# Altium project mcb 2.0.PrjPcb
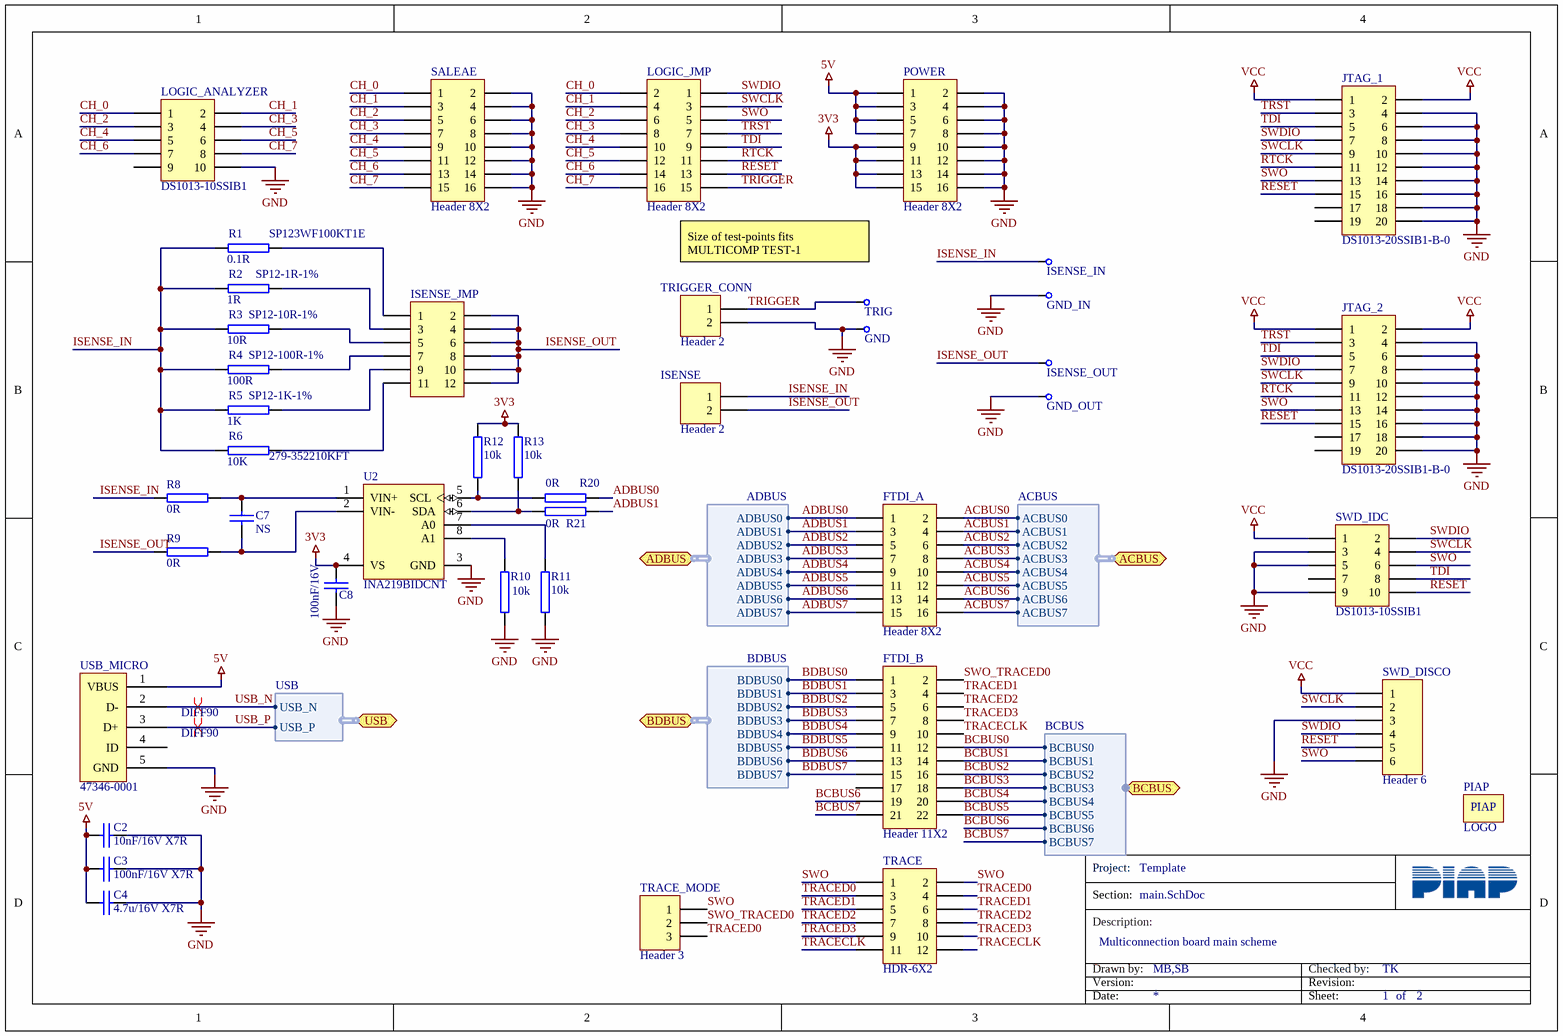
[diagram p0: main.SchDoc]
2 sheets, 79 parts. Net scope: flat (ports and power ports of the same name join across sheets).
Board file: mcb.PcbDoc
Sheets:
  main.SchDoc
  usb_converter.SchDoc

## Sheet main.SchDoc
size A4; CheckedBy: TK; DrawnBy: MB,SB; SheetNumber: 1; SheetTotal: 2; ProjectName: Template

### Parts
C2  10nF/16V X7R  [0805]
C3  100nF/16V X7R  [0805]
C4  4.7u/16V X7R  [0805]
C7  NS  [0603]
C8  100nF/16V  [0402]
FTDI_A  Header 8X2  [HDR2X8]
FTDI_B  Header 11X2  [HDR2X11]
GND  TEST_POINT_THT  [TEST_POINT_THT]  (value not drawn)  (no BOM)
GND_IN  TEST_POINT_THT  [TEST_POINT_THT]  (value not drawn)  (no BOM)
GND_OUT  TEST_POINT_THT  [TEST_POINT_THT]  (value not drawn)  (no BOM)
ISENSE  Header 2  [HDR1X2]
ISENSE_IN  TEST_POINT_THT  [TEST_POINT_THT]  (value not drawn)  (no BOM)
ISENSE_JMP  (no value)  [HDR2X6]
ISENSE_OUT  TEST_POINT_THT  [TEST_POINT_THT]  (value not drawn)  (no BOM)
JTAG_1  DS1013-20SSIB1-B-0  [HDR2X10]
JTAG_2  DS1013-20SSIB1-B-0  [HDR2X10]
LOGIC_ANALYZER  DS1013-10SSIB1  [HDR2X5 socet]
LOGIC_JMP  Header 8X2  [HDR2X8]
PIAP  LOGO  [PIAP_5mm]  (no BOM)
POWER  Header 8X2  [HDR2X8]
R1  0.1R  Manufacturer Part Number: SP123WF100KT1E  [2512]
R2  1R  Supplier Part Number 1: SP12-1R-1%  [2512]
R3  10R  Supplier Part Number 1: SP12-10R-1%  [2512]
R4  100R  Supplier Part Number 1: SP12-100R-1%  [2512]
R5  1K  Supplier Part Number 1: SP12-1K-1%  [2512]
R6  10K  Supplier Part Number 3: 279-352210KFT  [2512]
R8  0R  [0603]
R9  0R  [0603]
R10  10k  [0603]
R11  10k  [0603]
R12  10k  [0603]
R13  10k  [0603]
R20  0R  [0603]
R21  0R  [0603]
SALEAE  Header 8X2  [HDR2X8]
SWD_DISCO  Header 6  [HDR1X6]
SWD_IDC  DS1013-10SSIB1  [HDR2X5 socet]
TRACE  HDR-6X2  [HDR2X6]
TRACE_MODE  Header 3  [HDR1X3]
TRIG  TEST_POINT_THT  [TEST_POINT_THT]  (value not drawn)  (no BOM)
TRIGGER_CONN  Header 2  [HDR1X2]
U2  INA219BIDCNT  [DCN0008A_M]
USB_MICRO  47346-0001  [47346-0001]

### Ports
ACBUS (bidir, harness ACBUS), ADBUS (bidir, harness ADBUS), BCBUS (bidir, harness BCBUS), BDBUS (bidir, harness BDBUS), USB (bidir, harness USB)

### Harnesses
ADBUS: ADBUS0, ADBUS1, ADBUS2, ADBUS3, ADBUS4, ADBUS5, ADBUS6, ADBUS7
ACBUS: ACBUS0, ACBUS1, ACBUS2, ACBUS3, ACBUS4, ACBUS5, ACBUS6, ACBUS7
BDBUS: BDBUS0, BDBUS1, BDBUS2, BDBUS3, BDBUS4, BDBUS5, BDBUS6, BDBUS7
BCBUS: BCBUS0, BCBUS1, BCBUS2, BCBUS3, BCBUS4, BCBUS5, BCBUS6, BCBUS7
USB: USB_N, USB_P

### Nets
3V3: C8.1 POWER.9 POWER.11 POWER.13 POWER.15 R12.2 R13.2 U2.4(VS)
5V: C2.2 C3.1 C4.2 POWER.1 POWER.3 POWER.5 POWER.7 USB_MICRO.1(VBUS)
GND: C2.1 C3.2 C4.1 C8.2 GND.1 GND_IN.1 GND_OUT.1 JTAG_1.4 JTAG_1.6 JTAG_1.8 JTAG_1.10 JTAG_1.12 JTAG_1.14 JTAG_1.16 JTAG_1.18 JTAG_1.20 JTAG_2.4 JTAG_2.6 JTAG_2.8 JTAG_2.10 JTAG_2.12 JTAG_2.14 JTAG_2.16 JTAG_2.18 JTAG_2.20 LOGIC_ANALYZER.10 POWER.2 POWER.4 POWER.6 POWER.8 POWER.10 POWER.12 POWER.14 POWER.16 R10.2 R11.2 SALEAE.2 SALEAE.4 SALEAE.6 SALEAE.8 SALEAE.10 SALEAE.12 SALEAE.14 SALEAE.16 SWD_DISCO.3 SWD_IDC.3 SWD_IDC.5 SWD_IDC.9 TRIGGER_CONN.2 U2.3(GND) USB_MICRO.5(GND)
VCC: JTAG_1.1 JTAG_1.2 JTAG_2.1 JTAG_2.2 SWD_DISCO.1 SWD_IDC.1
ACBUS0: FTDI_A.2 ; port ACBUS.ACBUS0
ACBUS1: FTDI_A.4 ; port ACBUS.ACBUS1
ACBUS2: FTDI_A.6 ; port ACBUS.ACBUS2
ACBUS3: FTDI_A.8 ; port ACBUS.ACBUS3
ACBUS4: FTDI_A.10 ; port ACBUS.ACBUS4
ACBUS5: FTDI_A.12 ; port ACBUS.ACBUS5
ACBUS6: FTDI_A.14 ; port ACBUS.ACBUS6
ACBUS7: FTDI_A.16 ; port ACBUS.ACBUS7
ADBUS0: FTDI_A.1 R20.1 ; port ADBUS.ADBUS0
ADBUS1: FTDI_A.3 R21.1 ; port ADBUS.ADBUS1
ADBUS2: FTDI_A.5 ; port ADBUS.ADBUS2
ADBUS3: FTDI_A.7 ; port ADBUS.ADBUS3
ADBUS4: FTDI_A.9 ; port ADBUS.ADBUS4
ADBUS5: FTDI_A.11 ; port ADBUS.ADBUS5
ADBUS6: FTDI_A.13 ; port ADBUS.ADBUS6
ADBUS7: FTDI_A.15 ; port ADBUS.ADBUS7
BCBUS0: FTDI_B.12 ; port BCBUS.BCBUS0
BCBUS1: FTDI_B.14 ; port BCBUS.BCBUS1
BCBUS2: FTDI_B.16 ; port BCBUS.BCBUS2
BCBUS3: FTDI_B.18 ; port BCBUS.BCBUS3
BCBUS4: FTDI_B.20 ; port BCBUS.BCBUS4
BCBUS5: FTDI_B.22 ; port BCBUS.BCBUS5
BCBUS6: FTDI_B.19 ; port BCBUS.BCBUS6
BCBUS7: FTDI_B.21 ; port BCBUS.BCBUS7
BDBUS0: FTDI_B.1 ; port BDBUS.BDBUS0
BDBUS1: FTDI_B.3 ; port BDBUS.BDBUS1
BDBUS2: FTDI_B.5 ; port BDBUS.BDBUS2
BDBUS3: FTDI_B.7 ; port BDBUS.BDBUS3
BDBUS4: FTDI_B.9 ; port BDBUS.BDBUS4
BDBUS5: FTDI_B.11 ; port BDBUS.BDBUS5
BDBUS6: FTDI_B.13 ; port BDBUS.BDBUS6
BDBUS7: FTDI_B.15 ; port BDBUS.BDBUS7
CH_0: LOGIC_ANALYZER.1 LOGIC_JMP.2 SALEAE.1
CH_1: LOGIC_ANALYZER.2 LOGIC_JMP.4 SALEAE.3
CH_2: LOGIC_ANALYZER.3 LOGIC_JMP.6 SALEAE.5
CH_3: LOGIC_ANALYZER.4 LOGIC_JMP.8 SALEAE.7
CH_4: LOGIC_ANALYZER.5 LOGIC_JMP.10 SALEAE.9
CH_5: LOGIC_ANALYZER.6 LOGIC_JMP.12 SALEAE.11
CH_6: LOGIC_ANALYZER.7 LOGIC_JMP.14 SALEAE.13
CH_7: LOGIC_ANALYZER.8 LOGIC_JMP.16 SALEAE.15
ISENSE_IN: ISENSE.1 ISENSE_IN.1 R1.1 R2.1 R3.1 R4.1 R5.1 R6.1 R8.2
ISENSE_OUT: ISENSE.2 ISENSE_JMP.2 ISENSE_JMP.4 ISENSE_JMP.6 ISENSE_JMP.8 ISENSE_JMP.10 ISENSE_JMP.12 ISENSE_OUT.1 R9.2
RESET: JTAG_1.15 JTAG_2.15 LOGIC_JMP.13 SWD_DISCO.5 SWD_IDC.10
RTCK: JTAG_1.11 JTAG_2.11 LOGIC_JMP.11
SWCLK: JTAG_1.9 JTAG_2.9 LOGIC_JMP.3 SWD_DISCO.2 SWD_IDC.4
SWDIO: JTAG_1.7 JTAG_2.7 LOGIC_JMP.1 SWD_DISCO.4 SWD_IDC.2
SWO: JTAG_1.13 JTAG_2.13 LOGIC_JMP.5 SWD_DISCO.6 SWD_IDC.6 TRACE.1 TRACE.2 TRACE_MODE.1
SWO_TRACED0: FTDI_B.2 TRACE_MODE.2
TDI: JTAG_1.5 JTAG_2.5 LOGIC_JMP.9 SWD_IDC.8
TRACECLK: FTDI_B.10 TRACE.11 TRACE.12
TRACED0: TRACE.3 TRACE.4 TRACE_MODE.3
TRACED1: FTDI_B.4 TRACE.5 TRACE.6
TRACED2: FTDI_B.6 TRACE.7 TRACE.8
TRACED3: FTDI_B.8 TRACE.9 TRACE.10
TRIGGER: LOGIC_JMP.15 TRIG.1 TRIGGER_CONN.1
TRST: JTAG_1.3 JTAG_2.3 LOGIC_JMP.7
USB_N: USB_MICRO.2(D-) ; port USB.USB_N
USB_P: USB_MICRO.3(D+) ; port USB.USB_P
NetC7_1: C7.1 R9.1 U2.2(VIN-)
NetC7_2: C7.2 R8.1 U2.1(VIN+)
NetISENSE_JMP_1: ISENSE_JMP.1 R1.2
NetISENSE_JMP_3: ISENSE_JMP.3 R2.2
NetISENSE_JMP_5: ISENSE_JMP.5 R3.2
NetISENSE_JMP_7: ISENSE_JMP.7 R4.2
NetISENSE_JMP_9: ISENSE_JMP.9 R5.2
NetISENSE_JMP_11: ISENSE_JMP.11 R6.2
NetR10_1: R10.1 U2.8(A1)
NetR11_1: R11.1 U2.7(A0)
NetR12_1: R12.1 R20.2 U2.5(SCL)
NetR13_1: R13.1 R21.2 U2.6(SDA)

Not connected (* = marked no-connect by the designer): FTDI_B 17; JTAG_1 17 19; JTAG_2 17 19; LOGIC_ANALYZER 9; SWD_IDC 7; USB_MICRO 4(ID)

### Layout directives
differential pair; differential pair class DIFF90; rule Differential Pairs Routing [Pref Gap = 10mil    Min Gap  = 10mil    Max Gap  = 10milPref Width = 15mil    Min Width  = 15mil    Max Width  = 15mil]: USB_N, USB_P

### Notes on the sheet
- Size of test-points fits MULTICOMP TEST-1
- Multiconnection board main scheme
- Project:
- Section:
- Description:
- Drawn by:
- Version:
- Checked by:
- Revision:
- Date:
- Sheet:
- of

### Library data of the parts
C2 = n100: Chip Capacitor 10nF/16V X7R; Dostawca: Farnell; Tel/Fax: +48 12 4424724; email: AGrabowska@farnell.com; Opis: Chip Capacitor; Value: 10nF/16V X7R
C3 = n100: Chip Capacitor 100nF/16V X7R; Dostawca: Farnell; Tel/Fax: +48 12 4424724; email: AGrabowska@farnell.com; Opis: Chip Capacitor; Value: 100nF/16V X7R
C4 = n100: Chip Capacitor 4.7u/16V X7R; Dostawca: Farnell; Tel/Fax: +48 12 4424724; email: AGrabowska@farnell.com; Opis: Chip Capacitor; Value: 4.7u/16V X7R
C7 = n100: Opis: Chip Capacitor; Dostawca: Farnell; Tel/Fax: +48 12 4424724; email: AGrabowska@farnell.com; Value: NS
C8 = n100: NS; Opis: Chip Capacitor; Dostawca: Farnell; Tel/Fax: +48 12 4424724; email: AGrabowska@farnell.com; Value: 100nF/16V
FTDI_A LOGIC_JMP POWER SALEAE = Header 8X2: Header, 16-Pin, Dual row, 2.54mm; Dostawca: TME; Nr Katalogowy: 280385-2; Cena jednostkowa: 7,59; Value: Header 8X2
FTDI_B = Header 11X2: Header, 22-Pin, Dual row, 2.54mm; Value: Header 11X2
ISENSE TRIGGER_CONN = Header 2: Header, 2-Pin,  2.54mm; Dostawca: TME; Nr Katalogowy: 280370-2; Cena jednostkowa: 1,89; Value: Header 2
ISENSE_JMP = Header 6X2: Header, 6-Pin, Dual row; LatestRevisionDate: 17-Jul-2002; LatestRevisionNote: Re-released for DXP Platform.; Publisher: Altium Limited; Supplier 1: Farnell; Supplier Part Number 1: 1022237; Supplier 2: Mouser; Supplier Part Number 2: 855-M20-9980645
JTAG_1 JTAG_2 = Header 10X2: Header, 20-Pin, Dual row, 2.54mm; Value: Header 10X2; Supplier 1: TME; Manufacturer Part Number: DS1013-20SSIB1-B-0; Stock 1: 60169; Pricing 1: 2=0.3333, 10=0.2271, 100=0.1514, 1000=0.1261, 3000=0.1009 (USD)
LOGIC_ANALYZER SWD_IDC = Header 5X2: Header, 10-Pin, Dual row, 2.54mm; Dostawca: TME; Value: Header 5X2; Supplier 1: TME; Manufacturer Part Number: DS1013-10SSIB1; Stock 1: 66977; Pricing 1: 10=0.097, 50=0.0772, 200=0.0661, 1000=0.0551, 5000=0.0441 (USD)
PIAP = LOGO: Logo PIAP
R1 = 1R: Resistor 0.1R 3W 1%; Manufacturer: Royal Electronic Factory; Dostawca: Farnell; Dokładność: 5%; Value: 0.1R; Stock 1: 0; Pricing 1: 1=0.772, 10=0.363, 100=0.227, 1000=0.173, 4000=0.1545 (USD); ComponentLink1URL: http://datasheet.octopart.com/SP123WF100KT1E-Royal-Ohm-datasheet-86661178.pdf; ComponentLink1Description: http://datasheet.octopart.com/SP123WF100KT1E-Royal-Ohm-datasheet-86661178.pdf; Supplier 1: Digi-Key; Supplier Part Number 1: A103632CT-ND; Supplier 2: Farnell; Supplier Part Number 2: 1086356
R2 = 1R: Resistor 1R 3W 1%; Manufacturer: Royal Electronic Factory; Manufacturer Part Number: SP123WF100KT1E; Dostawca: Farnell; Dokładność: 1%; Value: 1R; Supplier 1: TME; Stock 1: 0; Pricing 1: 1=0.772, 10=0.363, 100=0.227, 1000=0.173, 4000=0.1545 (USD); ComponentLink1URL: http://datasheet.octopart.com/SP123WF100KT1E-Royal-Ohm-datasheet-86661178.pdf; ComponentLink1Description: http://datasheet.octopart.com/SP123WF100KT1E-Royal-Ohm-datasheet-86661178.pdf
R3 = 1R: Resistor 10R 3W 1%; Manufacturer: Royal Electronic Factory; Manufacturer Part Number: SP123WF100JT1E; Dostawca: Farnell; Dokładność: 1%; Value: 10R; Supplier 1: TME; Stock 1: 410; Pricing 1: 1=0.772, 10=0.363, 100=0.227, 1000=0.173, 4000=0.1545 (USD); ComponentLink1URL: http://datasheet.octopart.com/SP123WF100JT1E-Royal-Ohm-datasheet-86661178.pdf; ComponentLink1Description: http://datasheet.octopart.com/SP123WF100JT1E-Royal-Ohm-datasheet-86661178.pdf
R4 = 1R: Resistor 100R 2W 1%; Manufacturer: Royal Electronic Factory; Manufacturer Part Number: SP123WJ0101T1E; Dostawca: Farnell; Dokładność: 1%; Value: 100R; Supplier 1: TME; Stock 1: 1973; Pricing 1: 5=0.315, 25=0.214, 100=0.134, 1000=0.102, 4000=0.0909 (USD); ComponentLink1URL: http://datasheet.octopart.com/SP123WJ0101T1E-Royal-Ohm-datasheet-86661178.pdf; ComponentLink1Description: http://datasheet.octopart.com/SP123WJ0101T1E-Royal-Ohm-datasheet-86661178.pdf
R5 = 1R: Resistor 1k 2W 1%; Manufacturer: Royal Electronic Factory; Manufacturer Part Number: SP123WF1001T1E; Dostawca: Farnell; Dokładność: 1%; Value: 1K; Supplier 1: TME; Stock 1: 718; Pricing 1: 1=0.772, 10=0.363, 100=0.227, 1000=0.173, 4000=0.1545 (USD); ComponentLink1URL: http://datasheet.octopart.com/SP123WF1001T1E-Royal-Ohm-datasheet-86661178.pdf; ComponentLink1Description: http://datasheet.octopart.com/SP123WF1001T1E-Royal-Ohm-datasheet-86661178.pdf
R6 = 1R: Resistor 10K 3W 1%; Manufacturer: Royal Electronic Factory; Manufacturer Part Number: SP123WF100KT1E; Dostawca: Farnell; Dokładność: 1%; Value: 10K; Stock 1: 0; Pricing 1: 1=0.772, 10=0.363, 100=0.227, 1000=0.173, 4000=0.1545 (USD); ComponentLink1URL: http://datasheet.octopart.com/SP123WF100KT1E-Royal-Ohm-datasheet-86661178.pdf; ComponentLink1Description: http://datasheet.octopart.com/SP123WF100KT1E-Royal-Ohm-datasheet-86661178.pdf; Supplier 1: Digi-Key; Supplier Part Number 1: A121120CT-ND; Supplier 2: Farnell; Supplier Part Number 2: 2476512; Supplier 3: Mouser
R8 R10-R13 R20 R21 = k100: Chip Resistor 0Ohm 0.25W; ID: CRCW0805100KFKEA; Nr Katalogowy: 1469860; Dostawca: Farnell; Dokładność: 1%; HelpURL: http://www.vishay.com/docs/20035/dcrcwe3.pdf
  R8 R20 R21: Value: 0R
  R10-R13: Value: 10k
R9 = k100: Chip Resistor 0 Ohm 0.25W; ID: CRCW0805100KFKEA; Nr Katalogowy: 1469860; Dostawca: Farnell; Dokładność: 1%; HelpURL: http://www.vishay.com/docs/20035/dcrcwe3.pdf; Value: 0R
SWD_DISCO = Header 6: Header, 6-Pin, 2.54mm; Dostawca: TME; Nr Katalogowy: ZL262-6SG; Cena jednostkowa: 0,33; Value: Header 6
TRACE = Header 6x2: Header, 12-Pin, Dual row, SMD, 2.54mm; Value: HDR-6X2
TRACE_MODE = Header 3: Header, 3-Pin,  2.54mm; Value: Header 3
U2 = CMP-0704-00042-2: Zero-Drift, Bi-Directional Current / Power Monitor, 3 to 5.5 V, -40 to 125 degC, 8-pin SOP (DCN8), Green (RoHS & no Sb/Br); Manufacturer: Texas Instruments; SubFamily: Current Shunt Monitor; Common Mode Range(Min)(V): 0; Vs(Max)(V): 5.5; Input Offset (+/-)(Max)(uV): 50; Small-Signal Bandwidth(Typ)(MHz): 0.011; CMRR(Min)(dB): 100; Gain(V/V): 1, 0.5, 0.25, 0.125; Vs(Min)(V): 3; Common Mode Range(Max)(V): 26; Rating: Catalog; Quiescent Current (+/-)(Typ)(mA): 0.7; ComponentLink1URL: http://www.ti.com/; PartNumber: INA219BIDCNT; Mounting Technology: Surface Mount; ComponentLink3Description: Package Specification; PackageReference: DCN0008A; PackageVersion: 4202106/D, 11/2009; DatasheetVersion: SBOS448F; Eco-Plan: Green (RoHS & no Sb/Br); ComponentLink2URL: http://www.ti.com/general/docs/lit/getliterature.tsp?genericPartNumber=INA219&fileType=pdf; ComponentLink3URL: http://www.ti.com/lit/ml/mpds099c/mpds099c.pdf; Code_JEDEC: MO-178; ComponentLink1Description: Manufacturer URL; PackageDescription: 8-Pin Plastic Small Outline, Body 1.6 x 2.9 mm, Pitch 0.65 mm; ComponentLink2Description: Datasheet; Supplier 1: Mouser; Supplier Part Number 1: 595-INA219BIDCNT

## Sheet usb_converter.SchDoc
size A4; CheckedBy: TK; DrawnBy: MB,SB; SheetNumber: 2; SheetTotal: 2; ProjectName: Template
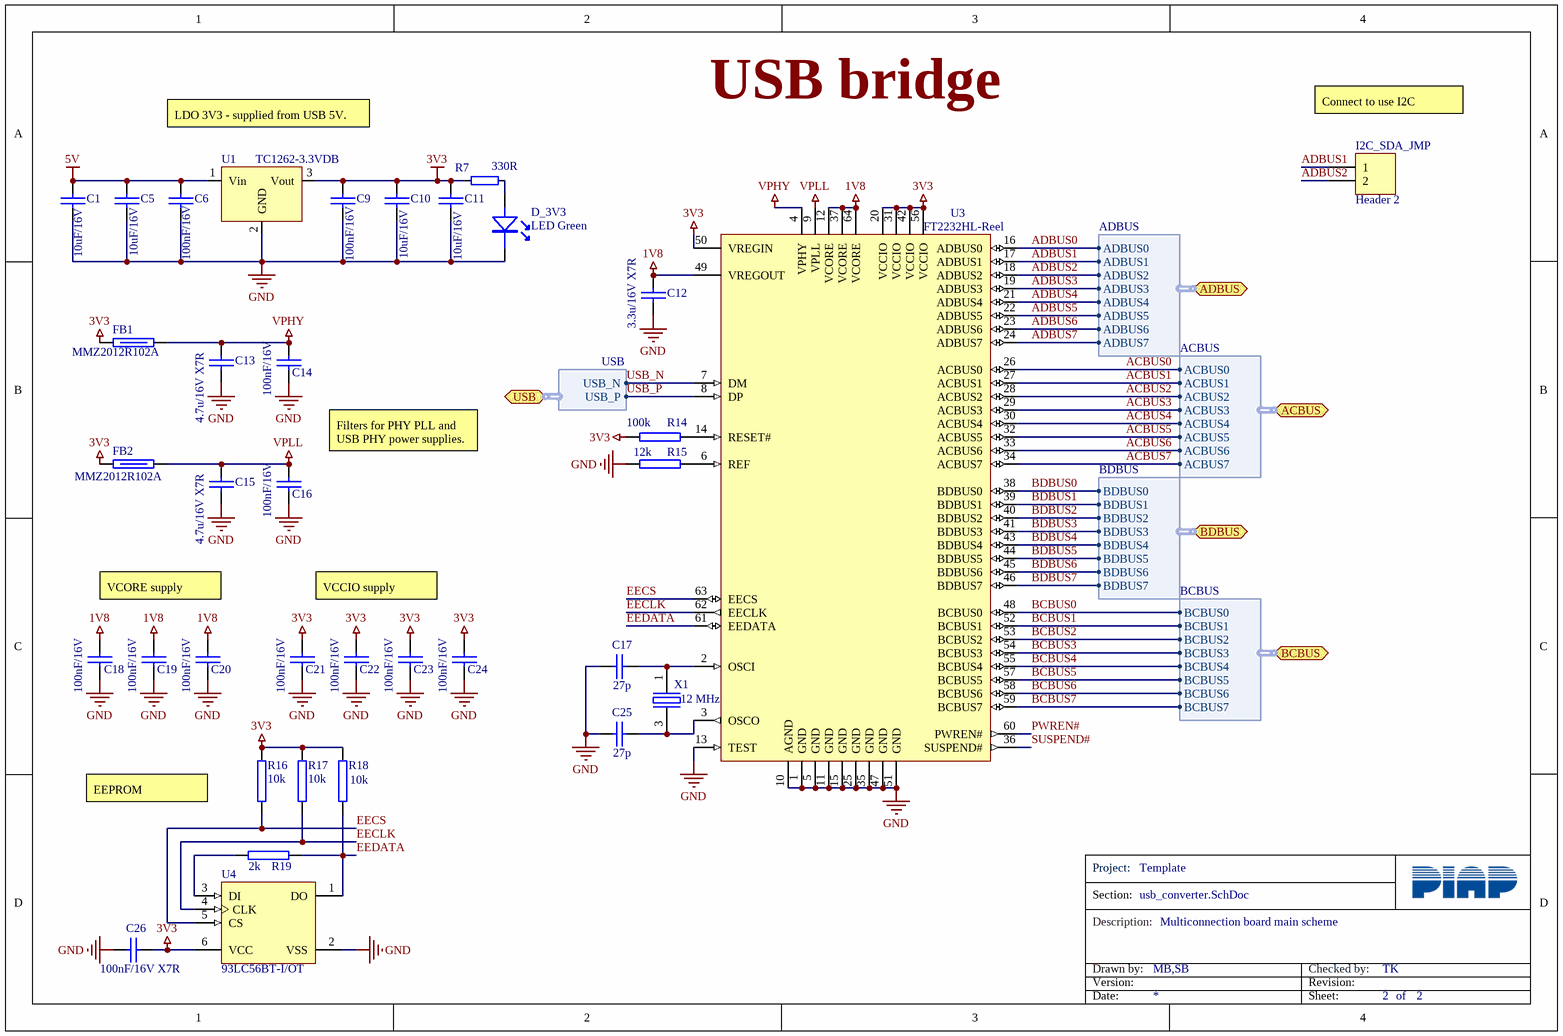
[diagram p1: usb_converter.SchDoc]

### Parts
C1  10uF/16V  [0603]
C5  10uF/16V  [0603]
C6  100nF/16V  [0603]
C9  100nF/16V  [0603]
C10  10uF/16V  [0603]
C11  10uF/16V  [0603]
C12  3.3u/16V X7R  [0805]
C13  4.7u/16V X7R  [0805]
C14  100nF/16V  [0603]
C15  4.7u/16V X7R  [0805]
C16  100nF/16V  [0603]
C17  27p  [0603]
C18  100nF/16V  [0603]
C19  100nF/16V  [0603]
C20  100nF/16V  [0603]
C21  100nF/16V  [0603]
C22  100nF/16V  [0603]
C23  100nF/16V  [0603]
C24  100nF/16V  [0603]
C25  27p  [0603]
C26  100nF/16V X7R  [0805]
D_3V3  LED Green  [LED SMD 0805]
FB1  MMZ2012R102A  [0805]
FB2  MMZ2012R102A  [0805]
I2C_SDA_JMP  Header 2  [HDR1X2]
R7  330R  [0603]
R14  100k  [0603]
R15  12k  [0603]
R16  10k  [0603]
R17  10k  [0603]
R18  10k  [0603]
R19  2k  [0603]
U1  TC1262-3.3VDB  [SOT223]
U3  FT2232HL-Reel  [LQFP-64_L]
U4  93LC56BT-I/OT  [SOT-23-OT6_L]
X1  12 MHz  [ABM8G]

### Ports
ACBUS (bidir, harness ACBUS), ADBUS (bidir, harness ADBUS), BCBUS (bidir, harness BCBUS), BDBUS (bidir, harness BDBUS), USB (bidir, harness USB)

### Harnesses
ADBUS: ADBUS0, ADBUS1, ADBUS2, ADBUS3, ADBUS4, ADBUS5, ADBUS6, ADBUS7
ACBUS: ACBUS0, ACBUS1, ACBUS2, ACBUS3, ACBUS4, ACBUS5, ACBUS6, ACBUS7
BDBUS: BDBUS0, BDBUS1, BDBUS2, BDBUS3, BDBUS4, BDBUS5, BDBUS6, BDBUS7
BCBUS: BCBUS0, BCBUS1, BCBUS2, BCBUS3, BCBUS4, BCBUS5, BCBUS6, BCBUS7
USB: USB_N, USB_P

### Nets
1V8: C12.1 C18.1 C19.1 C20.1 U3.12(VCORE) U3.37(VCORE) U3.49(VREGOUT) U3.64(VCORE)
3V3: C9.2 C10.2 C11.2 C21.1 C22.1 C23.1 C24.1 C26.2 FB1.2 FB2.2 R7.1 R14.2 R16.1 R17.1 R18.1 U1.3(Vout) U3.20(VCCIO) U3.31(VCCIO) U3.42(VCCIO) U3.50(VREGIN) U3.56(VCCIO) U4.6(VCC)
5V: C1.2 C5.2 C6.2 U1.1(Vin)
GND: C1.1 C5.1 C6.1 C9.1 C10.1 C11.1 C12.2 C13.2 C14.2 C15.2 C16.2 C17.2 C18.2 C19.2 C20.2 C21.2 C22.2 C23.2 C24.2 C25.2 C26.1 D_3V3.2 R15.2 U1.2(GND) U3.1(GND) U3.5(GND) U3.10(AGND) U3.11(GND) U3.13(TEST) U3.15(GND) U3.25(GND) U3.35(GND) U3.47(GND) U3.51(GND) U4.2(VSS)
VPHY: C13.1 C14.1 FB1.1 U3.4(VPHY)
VPLL: C15.1 C16.1 FB2.1 U3.9(VPLL)
ACBUS0: U3.26(ACBUS0) ; port ACBUS.ACBUS0
ACBUS1: U3.27(ACBUS1) ; port ACBUS.ACBUS1
ACBUS2: U3.28(ACBUS2) ; port ACBUS.ACBUS2
ACBUS3: U3.29(ACBUS3) ; port ACBUS.ACBUS3
ACBUS4: U3.30(ACBUS4) ; port ACBUS.ACBUS4
ACBUS5: U3.32(ACBUS5) ; port ACBUS.ACBUS5
ACBUS6: U3.33(ACBUS6) ; port ACBUS.ACBUS6
ACBUS7: U3.34(ACBUS7) ; port ACBUS.ACBUS7
ADBUS0: U3.16(ADBUS0) ; port ADBUS.ADBUS0
ADBUS1: I2C_SDA_JMP.1 U3.17(ADBUS1) ; port ADBUS.ADBUS1
ADBUS2: I2C_SDA_JMP.2 U3.18(ADBUS2) ; port ADBUS.ADBUS2
ADBUS3: U3.19(ADBUS3) ; port ADBUS.ADBUS3
ADBUS4: U3.21(ADBUS4) ; port ADBUS.ADBUS4
ADBUS5: U3.22(ADBUS5) ; port ADBUS.ADBUS5
ADBUS6: U3.23(ADBUS6) ; port ADBUS.ADBUS6
ADBUS7: U3.24(ADBUS7) ; port ADBUS.ADBUS7
BCBUS0: U3.48(BCBUS0) ; port BCBUS.BCBUS0
BCBUS1: U3.52(BCBUS1) ; port BCBUS.BCBUS1
BCBUS2: U3.53(BCBUS2) ; port BCBUS.BCBUS2
BCBUS3: U3.54(BCBUS3) ; port BCBUS.BCBUS3
BCBUS4: U3.55(BCBUS4) ; port BCBUS.BCBUS4
BCBUS5: U3.57(BCBUS5) ; port BCBUS.BCBUS5
BCBUS6: U3.58(BCBUS6) ; port BCBUS.BCBUS6
BCBUS7: U3.59(BCBUS7) ; port BCBUS.BCBUS7
BDBUS0: U3.38(BDBUS0) ; port BDBUS.BDBUS0
BDBUS1: U3.39(BDBUS1) ; port BDBUS.BDBUS1
BDBUS2: U3.40(BDBUS2) ; port BDBUS.BDBUS2
BDBUS3: U3.41(BDBUS3) ; port BDBUS.BDBUS3
BDBUS4: U3.43(BDBUS4) ; port BDBUS.BDBUS4
BDBUS5: U3.44(BDBUS5) ; port BDBUS.BDBUS5
BDBUS6: U3.45(BDBUS6) ; port BDBUS.BDBUS6
BDBUS7: U3.46(BDBUS7) ; port BDBUS.BDBUS7
EECLK: R17.2 U3.62(EECLK) U4.4(CLK)
EECS: R16.2 U3.63(EECS) U4.5(CS)
EEDATA: R18.2 R19.1 U3.61(EEDATA) U4.1(DO)
PWREN#: U3.60(PWREN#)
SUSPEND#: U3.36(SUSPEND#)
USB_N: U3.7(DM) ; port USB.USB_N
USB_P: U3.8(DP) ; port USB.USB_P
NetC17_1: C17.1 U3.2(OSCI) X1.1
NetC25_1: C25.1 U3.3(OSCO) X1.3
NetD_3V3_1: D_3V3.1 R7.2
NetR14_1: R14.1 U3.14(RESET#)
NetR15_1: R15.1 U3.6(REF)
NetR19_2: R19.2 U4.3(DI)

### Notes on the sheet
- USB bridge
- Connect to use I2C
- LDO 3V3 - supplied from USB 5V.
- Filters for PHY PLL and USB PHY power supplies.
- VCORE supply
- VCCIO supply
- EEPROM
- Multiconnection board main scheme
- Project:
- Section:
- Description:
- Drawn by:
- Version:
- Checked by:
- Revision:
- Date:
- Sheet:
- of

### Library data of the parts
C1 C5 C10 C11 = 100nF/16V/0603: 10uF,16V,0603,X5R, 10%; Supplier 1: Farnell; Dielectric: X5R; Tolerance: 10%
C6 C9 = 100nF/16V/0603: 100nF,16V,0603,,X7R; Tolerance: 10%; Supplier 1: Farnell; Dielectric: X7R
C12 = n100: Chip Capacitor 3.3u/16V X7R; Dostawca: Farnell; Tel/Fax: +48 12 4424724; email: AGrabowska@farnell.com; Opis: Chip Capacitor; Value: 3.3u/16V X7R
C13 C15 = n100: as C4 on sheet main; Opis: Chip Capacitor; Value: 4.7u/16V X7R
C14 C16-C25 = n100: as C8 on sheet main
  C14 C16 C18-C24: Value: 100nF/16V
  C17 C25: Value: 27p
C26 = n100: as C3 on sheet main; Opis: Chip Capacitor; Value: 100nF/16V X7R
D_3V3 = led_0805_green: LED Green 0805; Manufacturer Part Number: KP-2012SGD; HelpURL: O:\Protel\Library\Data Sheet\Optoelectronics\KP2012xxx.pdf; Supplier Part Number 1: KP-2012SGD; Supplier 1: TME
FB1 FB2 = MMZ2012R102A: Chip ferrite bead 500mA; Manufacturer Part Number: MMZ2012R102A; HelpURL: http://www.farnell.com/datasheets/84901.pdf; Supplier Part Number 1: 1669719; Supplier 1: Farnell
I2C_SDA_JMP = Header 2: as ISENSE on sheet main; Value: Header 2
R7 = res_0603: Chip Resistor 0402; Tolerance: 1%
R14 = k100: Chip Resistor 100k O.25W; ID: CRCW0805100KFKEA; Nr Katalogowy: 1469860; Dostawca: Farnell; Dokładność: 1%; HelpURL: http://www.vishay.com/docs/20035/dcrcwe3.pdf; Value: 100k
R15 R19 = k100: Chip Resistor 0.25W; Dostawca: Farnell; Dokładność: 1%
  R15: Value: 12k
  R19: Value: 2k
R16-R18 = k100: as R8 on sheet main; HelpURL: http://www.vishay.com/docs/20035/dcrcwe3.pdf; Value: 10k
U1 = TC1262-3.3VDB: 3-Terminal 3.3V 500mA Regulator; Manufacturer: MICROCHIP; HelpURL: O:\Protel\Library\Data Sheet\National\LM117,317.pdf; Manufacturer Part Number: TC1262-3.3VDB; Supplier Part Number 1: 1852183; Supplier 1: Farnell
U3 = CMP-0078-00023-2: Dual High Speed USB To Multipurpose UART/FIFO IC, LQFP-64, Tape and Reel; PackageVersion: 2010; DatasheetVersion: ver 2.10, Nov-2010; ComponentLink2Description: Datasheet; PackageReference: LQFP-64; PackageDescription: 64-Pin Thin Quad Flat Pack, 10 x 10 x 1.4 mm Body, 0.5 mm Pitch; ComponentLink1Description: Manufacturer URL; ComponentLink2URL: http://www.ftdichip.com/Support/Documents/DataSheets/ICs/DS_FT2232H.pdf; ComponentLink1URL: http://www.ftdichip.com/; RevisionNote: URLs added.
U4 = CMP-0162-00356-1: 2K, 128x16-bit, 2.5V Microwire Serial EEPROM, 6-Pin SOT-23, Industrial Temperature, Tape and Reel; DatasheetVersion: revF, May-2008; Code_IPC: SOT26A-6; PackageReference: SOT-23-OT6; PackageVersion: revBB, Aug-2009; PackageDescription: 6-Lead Plastic Small Outline Transistor (OT) [SOT-23]
X1 = ABM8G-12.000MHZ-4Y-T3: ABRACON  ABM8G-12.000MHZ  CRYSTAL, 12MHZ, 10PF, 3.2 X 2.5MM; Dostawca: Farnell; Nr katalogowy: 2467841; Cena jednostkowa: 3; url: http://pl.farnell.com/abracon/abm8g-16-000mhz-18-d2y-t/crystal-16mhz-18pf-3-2-x-2-5mm/dp/2467841; HelpURL: http://www.farnell.com/datasheets/1883677.pdf; Value: 12 MHz; ID: ABM8G-12.000MHZ; Manufacturer: ABRACON

## Nets that join several sheets
3V3: main (8 pins), usb_converter (22 pins)
5V: main (8 pins), usb_converter (C1.2 C5.2 C6.2 U1.1)
GND: main (51 pins), usb_converter (35 pins)
ACBUS0: main (FTDI_A.2), usb_converter (U3.26)
ACBUS1: main (FTDI_A.4), usb_converter (U3.27)
ACBUS2: main (FTDI_A.6), usb_converter (U3.28)
ACBUS3: main (FTDI_A.8), usb_converter (U3.29)
ACBUS4: main (FTDI_A.10), usb_converter (U3.30)
ACBUS5: main (FTDI_A.12), usb_converter (U3.32)
ACBUS6: main (FTDI_A.14), usb_converter (U3.33)
ACBUS7: main (FTDI_A.16), usb_converter (U3.34)
ADBUS0: main (FTDI_A.1 R20.1), usb_converter (U3.16)
ADBUS1: main (FTDI_A.3 R21.1), usb_converter (I2C_SDA_JMP.1 U3.17)
ADBUS2: main (FTDI_A.5), usb_converter (I2C_SDA_JMP.2 U3.18)
ADBUS3: main (FTDI_A.7), usb_converter (U3.19)
ADBUS4: main (FTDI_A.9), usb_converter (U3.21)
ADBUS5: main (FTDI_A.11), usb_converter (U3.22)
ADBUS6: main (FTDI_A.13), usb_converter (U3.23)
ADBUS7: main (FTDI_A.15), usb_converter (U3.24)
BCBUS0: main (FTDI_B.12), usb_converter (U3.48)
BCBUS1: main (FTDI_B.14), usb_converter (U3.52)
BCBUS2: main (FTDI_B.16), usb_converter (U3.53)
BCBUS3: main (FTDI_B.18), usb_converter (U3.54)
BCBUS4: main (FTDI_B.20), usb_converter (U3.55)
BCBUS5: main (FTDI_B.22), usb_converter (U3.57)
BCBUS6: main (FTDI_B.19), usb_converter (U3.58)
BCBUS7: main (FTDI_B.21), usb_converter (U3.59)
BDBUS0: main (FTDI_B.1), usb_converter (U3.38)
BDBUS1: main (FTDI_B.3), usb_converter (U3.39)
BDBUS2: main (FTDI_B.5), usb_converter (U3.40)
BDBUS3: main (FTDI_B.7), usb_converter (U3.41)
BDBUS4: main (FTDI_B.9), usb_converter (U3.43)
BDBUS5: main (FTDI_B.11), usb_converter (U3.44)
BDBUS6: main (FTDI_B.13), usb_converter (U3.45)
BDBUS7: main (FTDI_B.15), usb_converter (U3.46)
USB_N: main (USB_MICRO.2), usb_converter (U3.7)
USB_P: main (USB_MICRO.3), usb_converter (U3.8)